# EAGLE design z (EAGLE 7.1.0)
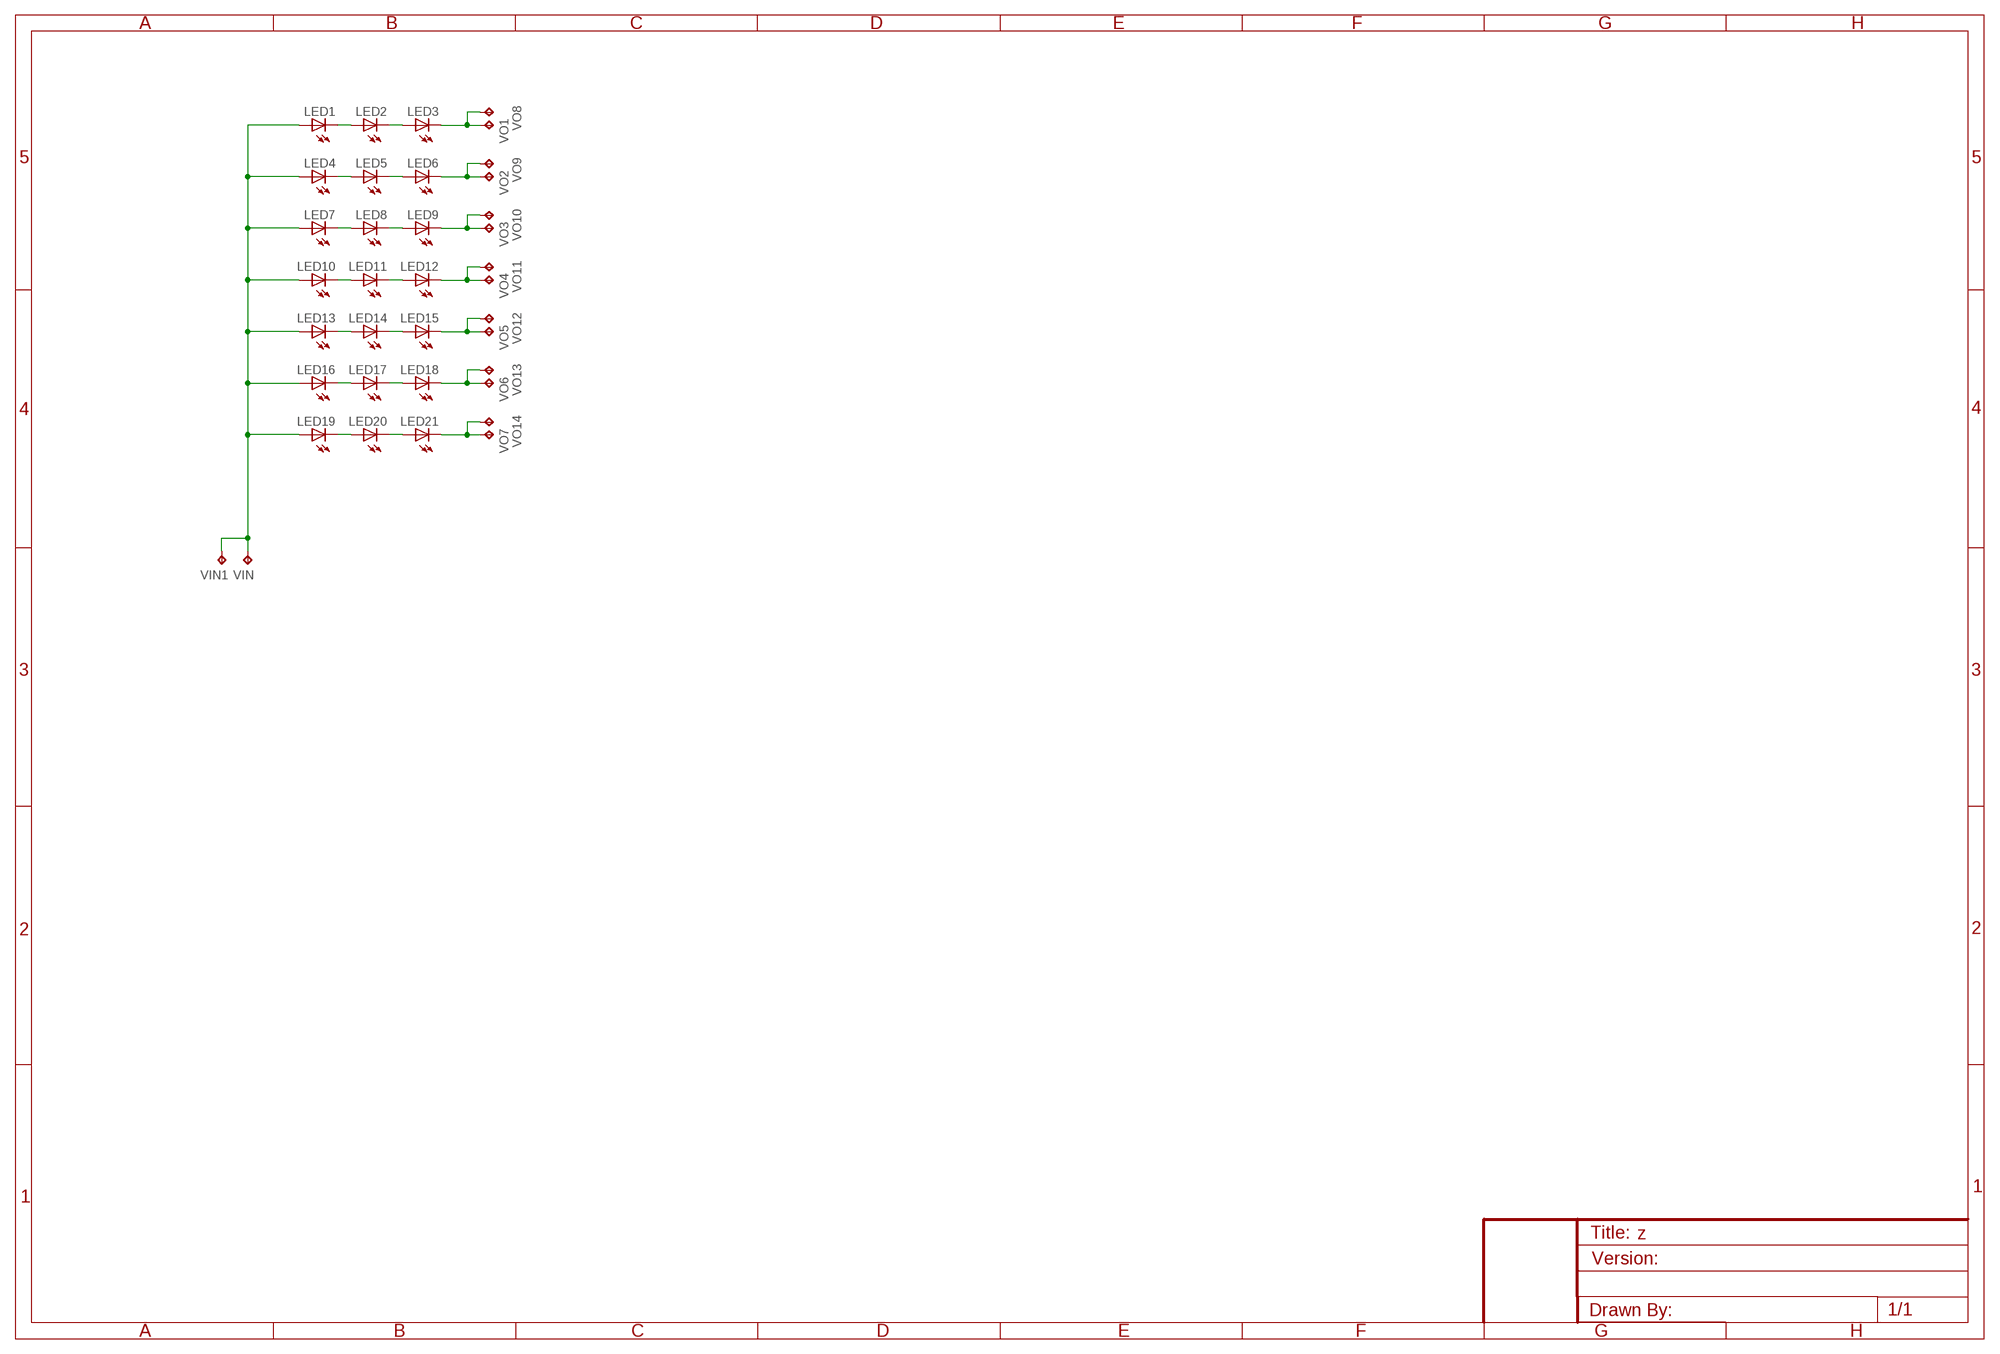
[diagram p0: schematic, sheet 1]

## Parts
LED1  LED0805  [LED_0805]
LED2  LED0805  [LED_0805]
LED3  LED0805  [LED_0805]
LED4  LED0805  [LED_0805]
LED5  LED0805  [LED_0805]
LED6  LED0805  [LED_0805]
LED7  LED0805  [LED_0805]
LED8  LED0805  [LED_0805]
LED9  LED0805  [LED_0805]
LED10  LED0805  [LED_0805]
LED11  LED0805  [LED_0805]
LED12  LED0805  [LED_0805]
LED13  LED0805  [LED_0805]
LED14  LED0805  [LED_0805]
LED15  LED0805  [LED_0805]
LED16  LED0805  [LED_0805]
LED17  LED0805  [LED_0805]
LED18  LED0805  [LED_0805]
LED19  LED0805  [LED_0805]
LED20  LED0805  [LED_0805]
LED21  LED0805  [LED_0805]
VIN  TEST_POINTPAD1-20  [P1-20]
VIN1  TEST_POINTPAD1-20  [P1-20]
VO1  TEST_POINTPAD1-20  [P1-20]
VO2  TEST_POINTPAD1-20  [P1-20]
VO3  TEST_POINTPAD1-20  [P1-20]
VO4  TEST_POINTPAD1-20  [P1-20]
VO5  TEST_POINTPAD1-20  [P1-20]
VO6  TEST_POINTPAD1-20  [P1-20]
VO7  TEST_POINTPAD1-20  [P1-20]
VO8  TEST_POINTPAD1-20  [P1-20]
VO9  TEST_POINTPAD1-20  [P1-20]
VO10  TEST_POINTPAD1-20  [P1-20]
VO11  TEST_POINTPAD1-20  [P1-20]
VO12  TEST_POINTPAD1-20  [P1-20]
VO13  TEST_POINTPAD1-20  [P1-20]
VO14  TEST_POINTPAD1-20  [P1-20]

## Nets
N$3: LED2.C LED3.A
N$4: LED1.C LED2.A
N$7: LED5.C LED6.A
N$8: LED4.C LED5.A
N$11: LED8.C LED9.A
N$12: LED7.C LED8.A
N$15: LED11.C LED12.A
N$16: LED10.C LED11.A
N$19: LED14.C LED15.A
N$20: LED13.C LED14.A
N$23: LED17.C LED18.A
N$24: LED16.C LED17.A
N$27: LED20.C LED21.A
N$28: LED19.C LED20.A
VIN: LED1.A LED4.A LED7.A LED10.A LED13.A LED16.A LED19.A VIN1.TP VIN.TP
VOUT1: LED3.C VO1.TP VO8.TP
VOUT2: LED6.C VO2.TP VO9.TP
VOUT3: LED9.C VO3.TP VO10.TP
VOUT4: LED12.C VO4.TP VO11.TP
VOUT5: LED15.C VO5.TP VO12.TP
VOUT6: LED18.C VO6.TP VO13.TP
VOUT7: LED21.C VO7.TP VO14.TP

## Library data of the parts
LED1-LED21 = CyberRailGuru:LED: LEDs Standard schematic elements and footprints for 5mm, 3mm, 1206, and 0603 sized LEDs. 5mm - Spark Fun Electronics SKU : COM-00529 (and others)
VIN VIN1 VO1-VO14 = CyberRailGuru:TEST_POINT: Test pad

## Board
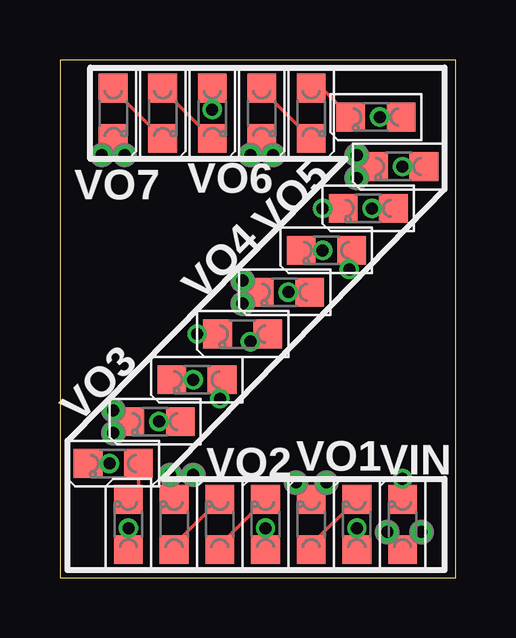
[diagram p1: board, top side]
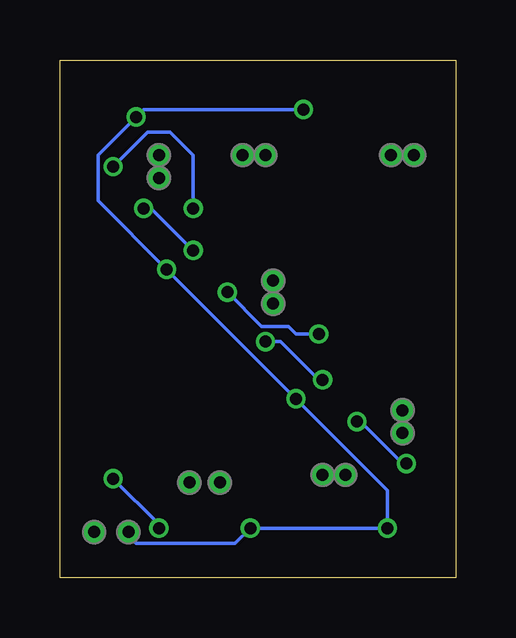
[diagram p2: board, bottom side, seen from below]

Size 16.51 x 21.59 mm. Coordinates in mm from the lower left corner, seen from the top.
Outline: 0,0 16.51,0 16.51,21.59 0,21.59 0,0
Copper layers (1*16): Top 0.035mm / dielectric 1.5mm / Bottom 0.035mm
Design rules "Fusion_eagle_rule_v1.1_tms *": minimum track width 6mil, minimum drill 12mil, track to track 6mil, track to pad 6mil, pad to pad 6mil, via to via 6mil, smd to smd 0mil, copper to edge 10mil, drill to drill 10mil, minimum pad ring 10mil, minimum via ring 6mil, stop-mask expansion 2mil, vias tented up to drill 100mil, thermal gap 10mil

### Footprints (pad centres in the part's own frame; a part is rotated, then mirrored left to right if it is on the bottom)
LED_0805 = smd 1.2 x 1.2: A 0,-1.05; C 0,1.05
P1-20 = drill 0.5: TP 0,0

### Placement (x,y rotation side)
LED1  14.29,2.22 0 top
LED2  12.38,2.22 0 top
LED3  10.48,2.22 0 top
LED4  8.57,2.22 0 top
LED5  6.67,2.22 0 top
LED6  4.76,2.22 0 top
LED7  2.86,2.22 0 top
LED8  2.22,4.76 90 top
LED9  3.97,6.51 90 top
LED10  5.71,8.26 90 top
LED11  7.62,10.16 90 top
LED12  9.37,11.91 90 top
LED13  11.11,13.65 90 top
LED14  12.86,15.4 90 top
LED15  14.13,17.14 90 top
LED16  13.18,19.21 90 top
LED17  10.48,19.37 180 top
LED18  8.41,19.37 180 top
LED19  6.35,19.37 180 top
LED20  4.29,19.37 180 top
LED21  2.22,19.37 180 top
VIN  15.08,1.91 0 top
VIN1  13.65,1.91 0 top
VO1  11.11,3.97 0 top
VO2  4.6,4.29 0 top
VO3  2.22,6.03 0 top
VO4  7.62,12.38 0 top
VO5  12.38,17.62 0 top
VO6  7.94,17.62 0 top
VO7  2.7,17.62 0 top
VO8  9.84,3.97 0 top
VO9  5.56,4.29 0 top
VO10  2.22,6.99 0 top
VO11  7.62,11.43 0 top
VO12  12.38,16.67 0 top
VO13  8.89,17.62 0 top
VO14  1.75,17.62 0 top

### Tracks (layer width: path | path; a pad name or v marks a point on that pad's centre or on a via)
N$3
  Top 0.152: LED3.A 10.48,1.37 LED2.C
N$4  (via drill 0.5)
  Top 0.152: LED2.A v12.38,2.06 | v14.29,4.13 LED1.C
  Bottom 0.152: v12.38,2.06 12.38,2.22 v14.29,4.13
N$7
  Top 0.152: LED6.A 4.76,1.37 LED5.C
N$8
  Top 0.152: LED5.A 6.67,1.37 LED4.C
N$11  (via drill 0.5)
  Top 0.152: LED8.C v2.06,4.76 | v4.13,6.51 LED9.A
  Bottom 0.152: v2.06,4.76 2.22,4.76 3.97,6.51 v4.13,6.51
N$12
  Top 0.152: LED8.A 3.27,3.69 LED7.C
N$15  (via drill 0.5)
  Top 0.152: LED11.C v5.71,10.16 | v9.53,11.91 LED12.A
  Bottom 0.152: v5.71,10.16 6.67,10.16 6.99,10.48 8.1,10.48 v9.53,11.91
N$16  (via drill 0.5)
  Top 0.152: LED10.C v5.56,8.26 | v7.94,9.84 8.35,9.84 LED11.A
  Bottom 0.152: v5.56,8.26 5.71,8.26 7.3,9.84 v7.94,9.84
N$19  (via drill 0.5)
  Top 0.152: LED14.C v10.95,15.4 | v14.29,17.14 LED15.A
  Bottom 0.152: v10.95,15.4 10.95,17.62 11.91,18.57 12.86,18.57 v14.29,17.14
N$20  (via drill 0.5)
  Top 0.152: LED13.C v10.95,13.65 | v13.02,15.4 LED14.A
  Bottom 0.152: v10.95,13.65 12.7,15.4 v13.02,15.4
N$23
  Top 0.152: LED18.A 8.41,20.38 LED17.C
N$24
  Top 0.152: LED17.A 10.92,20.42 LED16.C
N$27
  Top 0.152: LED21.A 2.22,20.38 LED20.C
N$28
  Top 0.152: LED20.A 4.29,20.38 LED19.C
VIN  (via drill 0.5)
  Top 0.152: VIN.TP 15.02,1.91 LED1.A 14.29,1.27 VIN1.TP | v8.57,2.06 LED4.A | LED7.A v2.86,2.06 | LED10.A 6.76,7.56 v6.67,7.46 | LED13.A 12.16,12.96 v12.06,12.86 | LED16.A v13.34,19.21 | LED19.A v6.35,19.53
  Bottom 0.152: v6.35,19.53 13.02,19.53 v13.34,19.21 14.92,17.62 14.92,15.72 v12.06,12.86 v6.67,7.46 2.86,3.65 v2.86,2.06 v8.57,2.06 9.21,1.43 13.34,1.43 13.65,1.75 VIN1.TP
VOUT1
  Top 0.152: VO1.TP 10.48,3.33 LED3.C 9.84,3.91 VO8.TP
VOUT2
  Top 0.152: LED6.C 4.76,4.13 VO2.TP VO9.TP
VOUT3
  Top 0.152: VO3.TP 2.44,6.03 LED9.C 2.44,6.99 VO10.TP
VOUT4
  Top 0.152: VO11.TP 7.84,11.43 LED12.C 7.84,12.38 VO4.TP
VOUT5
  Top 0.152: VO5.TP 12.6,17.62 LED15.C 12.6,16.67 VO12.TP
VOUT6
  Top 0.152: VO6.TP 7.94,17.84 LED18.C 8.89,17.84 VO13.TP
VOUT7
  Top 0.152: VO14.TP 1.75,17.84 LED21.C 2.7,17.84 VO7.TP

### Text on the board
201bmp: Z